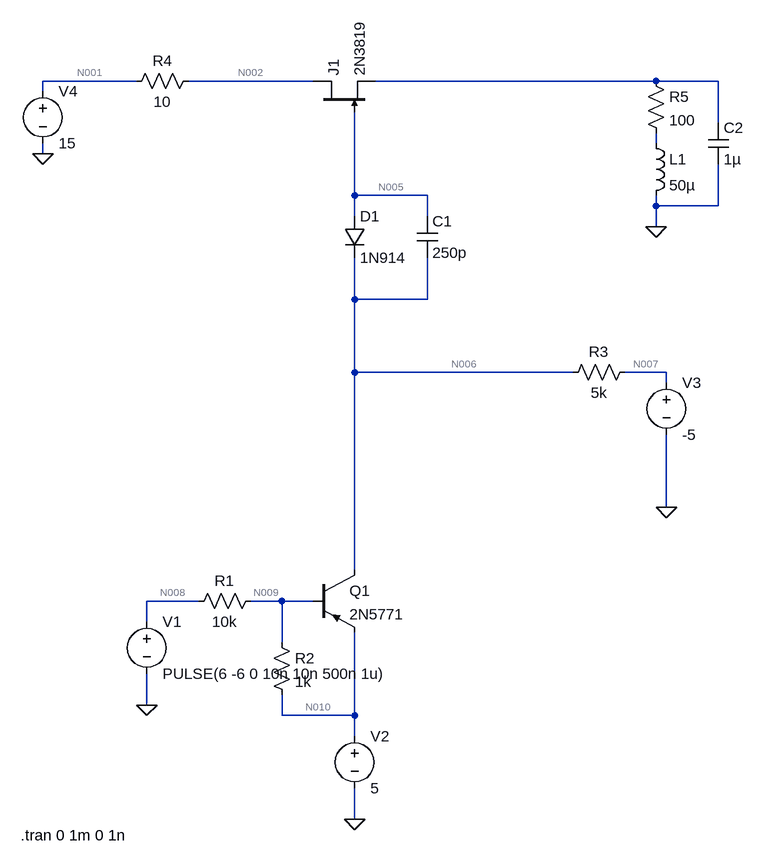
[diagram p0: schematic switch.asc]
switch.asc, the LTspice schematic file:
Version 4
SHEET 1 1048 680
WIRE 96 -688 -48 -688
WIRE 368 -688 176 -688
WIRE 896 -688 464 -688
WIRE 992 -688 896 -688
WIRE -48 -672 -48 -688
WIRE 992 -624 992 -688
WIRE 896 -592 896 -608
WIRE -48 -576 -48 -592
WIRE 432 -512 432 -640
WIRE 544 -512 432 -512
WIRE 896 -496 896 -512
WIRE 992 -496 992 -560
WIRE 992 -496 896 -496
WIRE 432 -480 432 -512
WIRE 544 -480 544 -512
WIRE 896 -464 896 -496
WIRE 432 -352 432 -416
WIRE 544 -352 544 -416
WIRE 544 -352 432 -352
WIRE 432 -240 432 -352
WIRE 768 -240 432 -240
WIRE 912 -240 848 -240
WIRE 912 -224 912 -240
WIRE 912 -32 912 -144
WIRE 432 64 432 -240
WIRE 192 112 112 112
WIRE 320 112 272 112
WIRE 368 112 320 112
WIRE 112 144 112 112
WIRE 320 176 320 112
WIRE 112 272 112 224
WIRE 320 288 320 256
WIRE 432 288 432 160
WIRE 432 288 320 288
WIRE 432 320 432 288
WIRE 432 448 432 400
FLAG 112 272 0
FLAG 432 448 0
FLAG 912 -32 0
FLAG -48 -576 0
FLAG 896 -464 0
SYMBOL voltage 112 128 R0
WINDOW 123 0 0 Left 0
WINDOW 39 0 0 Left 0
SYMATTR InstName V1
SYMATTR Value PULSE(6 -6 0 10n 10n 500n 1u)
SYMBOL pnp 368 64 R0
SYMATTR InstName Q1
SYMATTR Value 2N5771
SYMBOL res 288 96 R90
WINDOW 0 0 56 VBottom 2
WINDOW 3 32 56 VTop 2
SYMATTR InstName R1
SYMATTR Value 10k
SYMBOL res 304 160 R0
SYMATTR InstName R2
SYMATTR Value 1k
SYMBOL voltage 432 304 R0
WINDOW 123 0 0 Left 0
WINDOW 39 0 0 Left 0
SYMATTR InstName V2
SYMATTR Value 5
SYMBOL res 864 -256 R90
WINDOW 0 0 56 VBottom 2
WINDOW 3 32 56 VTop 2
SYMATTR InstName R3
SYMATTR Value 5k
SYMBOL voltage 912 -240 R0
WINDOW 123 0 0 Left 0
WINDOW 39 0 0 Left 0
SYMATTR InstName V3
SYMATTR Value -5
SYMBOL diode 416 -480 R0
SYMATTR InstName D1
SYMATTR Value 1N914
SYMBOL cap 528 -480 R0
SYMATTR InstName C1
SYMATTR Value 250p
SYMBOL njf 368 -640 R270
SYMATTR InstName J1
SYMATTR Value 2N3819
SYMBOL voltage -48 -688 R0
WINDOW 123 0 0 Left 0
WINDOW 39 0 0 Left 0
SYMATTR InstName V4
SYMATTR Value 15
SYMBOL res 192 -704 R90
WINDOW 0 0 56 VBottom 2
WINDOW 3 32 56 VTop 2
SYMATTR InstName R4
SYMATTR Value 10
SYMBOL res 880 -704 R0
SYMATTR InstName R5
SYMATTR Value 100
SYMBOL ind 880 -608 R0
SYMATTR InstName L1
SYMATTR Value 50µ
SYMBOL cap 976 -624 R0
SYMATTR InstName C2
SYMATTR Value 1µ
TEXT -82 472 Left 2 !.tran 0 1m 0 1n

The netlist it stands for:
* switch.asc
V1 N008 0 PULSE(6 -6 0 10n 10n 500n 1u)
Q1 N006 N009 N010 0 2N5771
R1 N009 N008 10k
R2 N009 N010 1k
V2 N010 0 5
R3 N007 N006 5k
V3 N007 0 -5
D1 N005 N006 1N914
C1 N005 N006 250p
J1 N002 N005 N003 2N3819
V4 N001 0 15
R4 N002 N001 10
R5 N003 N004 100
L1 N004 0 50µ
C2 N003 0 1µ
.model D D
.lib standard.dio
.model NPN NPN
.model PNP PNP
.lib standard.bjt
.model NJF NJF
.model PJF PJF
.lib standard.jft
.tran 0 1m 0 1n
.backanno
.end

* Results of the author's LTspice run, read from the files saved beside the schematic
* Operating Point, zero values left out:
*   V(n008) = 6 V
*   V(n006) = -5 V
*   V(n009) = 5.091 V
*   V(n010) = 5 V
*   V(n007) = -5 V
*   V(n005) = -5 V
*   V(n002) = 15 V
*   V(n001) = 15 V
*   Ic(Q1) = -10.09 pA
*   Ib(Q1) = 10.18 pA
*   I(D1) = 26.65 pA
*   I(L1) = -5.65 pA
*   Id(J1) = 21 pA
*   Ig(J1) = -26.65 pA
*   Is(J1) = 5.65 pA
*   I(R5) = -5.65 pA
*   I(R4) = -21 pA
*   I(R3) = -36.74 pA
*   I(R2) = 90.91 µA
*   I(R1) = -90.91 µA
*   I(V4) = -21 pA
*   I(V3) = 36.74 pA
*   I(V2) = 90.91 µA
*   I(V1) = -90.91 µA